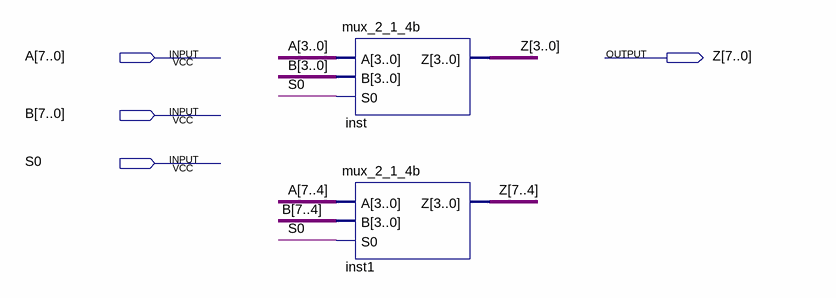
[diagram p0: schematic sheet]
// Quartus schematic mux_2_1_8b.bdf as structural Verilog: 2 symbols, 4 pins
module mux_2_1_8b (
  input  [7:0] A,
  input  [7:0] B,
  input  S0,
  output [7:0] Z
);

  mux_2_1_4b inst (.A(A[3:0]), .B(B[3:0]), .S0(S0), .Z(Z[3:0]));
  mux_2_1_4b inst1 (.A(A[7:4]), .B(B[7:4]), .S0(S0), .Z(Z[7:4]));
endmodule
